# Altium schematic sheet filter_circuit.SchDoc
size A4
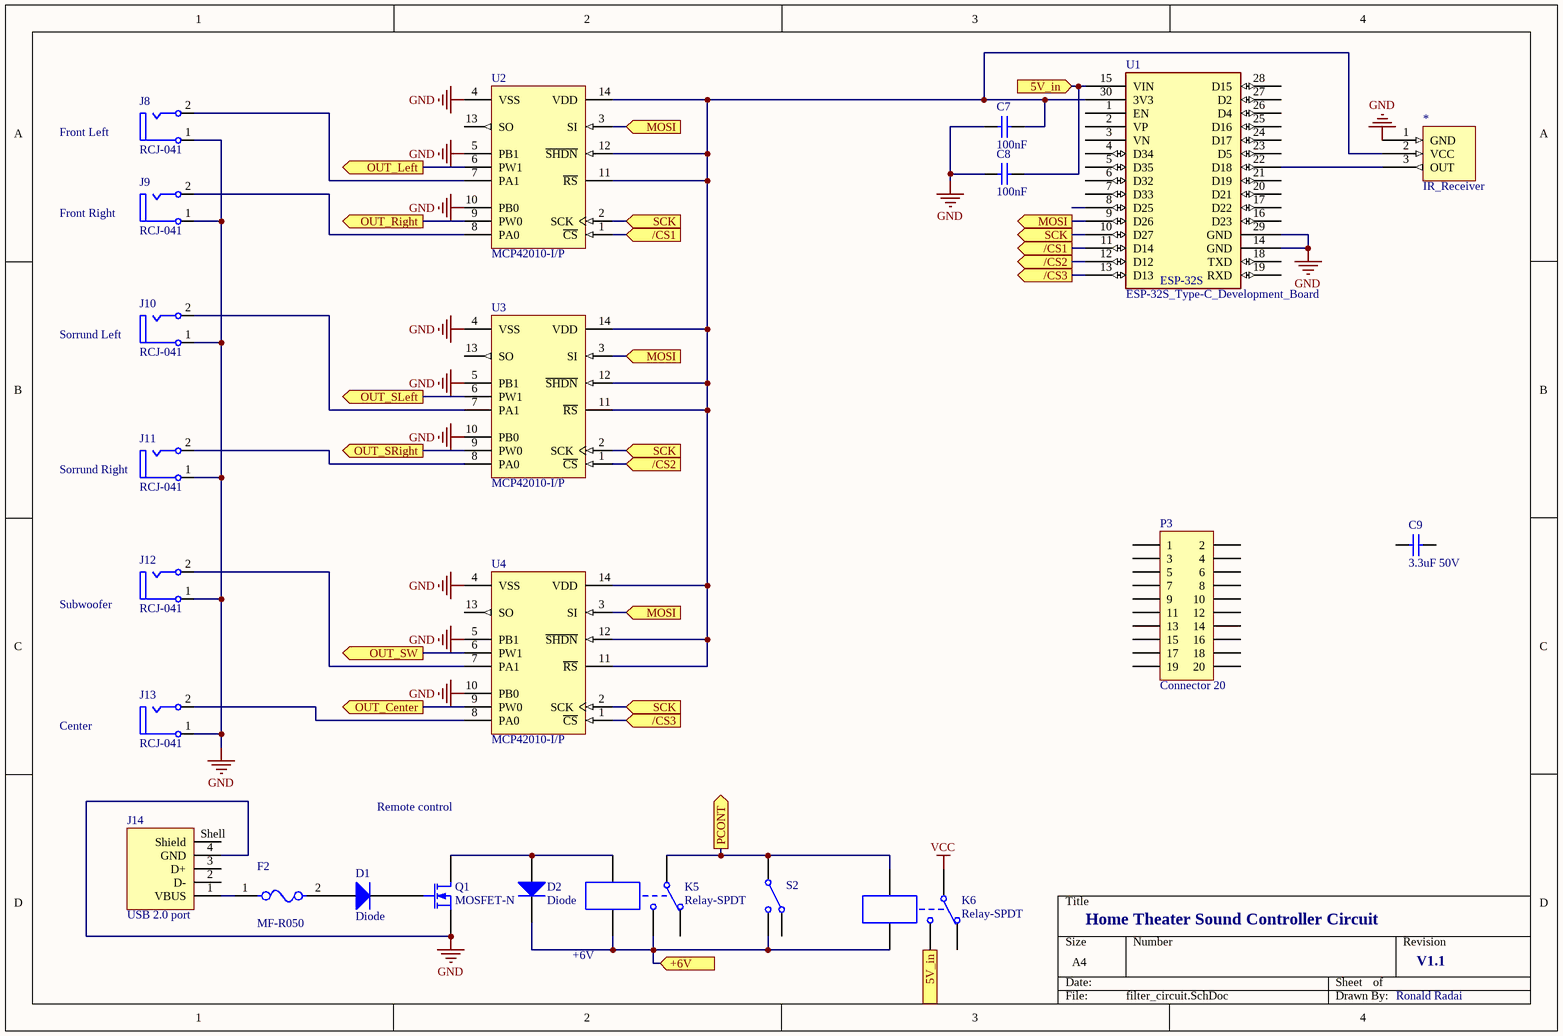
[diagram p0: filter_circuit.SchDoc]

## Parts
*  IR_Receiver
C7  100nF  [FP_0805_CAP_085]
C8  100nF  [FP_0805_CAP_085]
C9  3.3uF 50V  [FP_0805_CAP_085]
D1  Diode  [SMC]
D2  Diode  [SMC]
F2  MF-R050  [FP-MF-R050-MFG]
J8  RCJ-041  [CUI-RCJ-041_V]
J9  RCJ-041  [CUI-RCJ-041_V]
J10  RCJ-041  [CUI-RCJ-041_V]
J11  RCJ-041  [CUI-RCJ-041_V]
J12  RCJ-041  [CUI-RCJ-041_V]
J13  RCJ-041  [CUI-RCJ-041_V]
J14  USB 2.0 port  [629104151021]
K5  Relay-SPDT  [MODULE5B]
K6  Relay-SPDT  [MODULE5B]
P3  Connector 20  [CONNECTOR-20P]
Q1  MOSFET-N  [E3]
S2  Single-Pole, Double-Throw Switch  (value not drawn)
U1  ESP-32S_Type-C_Development_Board  [FP-ESP32-C3-DevKitC-02-MFG]
U2  MCP42010-I/P  [PDIP300-P14]
U3  MCP42010-I/P  [PDIP300-P14]
U4  MCP42010-I/P  [PDIP300-P14]

## Ports
5V_in (in), 5V_in (out), +6V (in), /CS1 (in), /CS1 (out), /CS2 (in), /CS2 (out), /CS3 (in), /CS3 (out), MOSI (in), MOSI (out), OUT_Center (out), OUT_Left (out), OUT_Right (out), OUT_SLeft (out), OUT_SRight (out), OUT_SW (out), PCONT (out), SCK (in), SCK (out)

## Nets
GND: *.1(GND) C7.2 C8.2 J8.1 J9.1 J10.1 J11.1 J12.1 J13.1 J14.4(GND) Q1.3(S) U1.14(GND) U1.29(GND) U2.4(VSS) U2.5(PB1) U2.10(PB0) U3.4(VSS) U3.5(PB1) U3.10(PB0) U4.4(VSS) U4.5(PB1) U4.10(PB0)
VCC: K6.1
5V_in: C8.1 K6.3 U1.15(VIN) ; port 5V_in
+6V: D2.2(K) K5.3 K5.5 K6.5 S2.2 ; port +6V
/CS1: U1.11(D14) U2.1(~{CS}) ; port /CS1
/CS2: U1.12(D12) U3.1(~{CS}) ; port /CS2
/CS3: U1.13(D13) U4.1(~{CS}) ; port /CS3
MOSI: U1.9(D26) U2.3(SI) U3.3(SI) U4.3(SI) ; port MOSI
OUT_Center: U4.9(PW0) ; port OUT_Center
OUT_Left: U2.6(PW1) ; port OUT_Left
OUT_Right: U2.9(PW0) ; port OUT_Right
OUT_SLeft: U3.6(PW1) ; port OUT_SLeft
OUT_SRight: U3.9(PW0) ; port OUT_SRight
OUT_SW: U4.6(PW1) ; port OUT_SW
PCONT: K5.1 K6.4 S2.1 ; port PCONT
SCK: U1.10(D27) U2.2(SCK) U3.2(SCK) U4.2(SCK) ; port SCK
Net*_2: *.2(VCC) C7.1 U1.30(3V3) U2.11(~{RS}) U2.12(~{SHDN}) U2.14(VDD) U3.11(~{RS}) U3.12(~{SHDN}) U3.14(VDD) U4.11(~{RS}) U4.12(~{SHDN}) U4.14(VDD)
Net*_3: *.3(OUT) U1.22(D18)
NetD1_1: D1.1(A) F2.2
NetD1_2: D1.2(K) Q1.2(G)
NetD2_1: D2.1(A) K5.4 Q1.1(D)
NetF2_1: F2.1 J14.1(VBUS)
NetJ8_2: J8.2 U2.7(PA1)
NetJ9_2: J9.2 U2.8(PA0)
NetJ10_2: J10.2 U3.7(PA1)
NetJ11_2: J11.2 U3.8(PA0)
NetJ12_2: J12.2 U4.7(PA1)
NetJ13_2: J13.2 U4.8(PA0)

Not connected (* = marked no-connect by the designer): C9 1 2; J14 2(D-) 3(D+) Shell(Shield); K5 2; K6 2; P3 1 2 3 4 5 6 7 8 9 10 11 12 13 14 15 16 17 18 19 20; S2 3; U1 1(EN) 2(VP) 3(VN) 4(D34) 5(D35) 6(D32) 7(D33) 8(D25) 16(D23) 17(D22) 18(TXD) 19(RXD) 20(D21) 21(D19) 23(D5) 24(D17) 25(D16) 26(D4) 27(D2) 28(D15); U2 13(SO); U3 13(SO); U4 13(SO)

## Notes on the sheet
- Front Left
- Front Right
- (near J10) Sorrund Left
- (near J11) Sorrund Right
- Subwoofer
- Center
- Remote control
- Home Theater Sound Controller Circuit
- +6V
- V1.1
- Ronald Radai
- (in symbol ESP-32S_TypeC_DevKit) ESP-32S

## Library data of the parts
C7-C9 = CAP: Capacitor
  C7 C8: Value: 100nF
  C9: Value: 3.3uF 50V
D1 D2 = Diode: Default Diode; Published: 8-Jun-2000; LatestRevisionDate: 17-Jul-2002; LatestRevisionNote: Re-released for DXP Platform.; PackageVersion: Sep-1996; PackageReference: SMC; Publisher: Altium Limited; PackageDescription: DO-214-AB/SMC; 2 C-Bend Leads; Body 7.9 x 5.9 mm, inc. leads (LxW); Code_JEDEC: DO-214-AB
F2 = CMP-07400-000037-1: PTC RESET FUSE 60V 500MA RADIAL; Manufacturer: Bourns; Current Rating: 40A; Trip Time: 4s; Resistance: 0.41-0.77Ω; Value: 0.41-0.77Ω; Trip Current: 1A; Hold Current: 0.5A; Automotive: No; Device Class L1: Circuit Protection; Ambient Temperature Range Low: -40°C; Height: 13.7mm; Category: Fuse; ComponentLink2Description: Datasheet; Device Class L3: unset; Mouser Description: PTC Resettable Fuse 0.5A(hold) 1A(trip) 60V 40A 0.75W 4s 0.41Ohm Radial 7.9 X 3.1mm Bulk; RoHS: TRUE; Temperature Range High: +85°C; Octopart: https://octopart.com/mf-r050-bourns-19418; Temperature Range Low: -40°C; Device Class L2: PTC Resettable Fuses; Package: MF-R050; Manufacturer Part Number: MF-R050; Temperature: -40°C to +85°C; Ambient Temperature Range High: +85°C; ComponentLink2URL: https://upverter.com/datasheet/a1b715b2a3574ae967878e49fe70c2811aecae4b.pdf; Digikey Description: PTC RESET FUSE 60V 500MA RADIAL; Lead Free: Yes; Voltage Rating: 60V
J8-J13 = CMP-1692-00002-1: Female RCJ Jack, 2 Position, Height 11.724 mm, Tail Length 4 mm, RoHS, Bulk; Case\Package: Metal; Connector Type: HDMI; Current Rating: 500 mA; Voltage Rating: 40 V; Length: 16.2 mm; Pins: 19; ComponentLink1URL: http://www.cui.com/; ComponentLink1Description: Manufacturer URL; Packaging: Tape and Reel; Lead Pitch: 0.5 mm; PackageDescription: Female RCJ Jack, 2 Position, Height 11.724 mm, Tail Length 4 mm; RoHSCompliant: true; Min Operating Temperature: -55 degC; Height: 6.1 mm; Contact Material: Copper; REACH SVHC: No SVHC; DatasheetVersion: Rev. B, 02/2012; ComponentLink2Description: Datasheet; Contact Plating: Gold; Colour: Black; Max Operating Temperature: 85 degC; Mount: Surface Mount; Package Quantity: 400; Gender: Female; ComponentLink2URL: http://www.cui.com/product/resource/rcj-04x.pdf; PackageReference: RCJ-041
J14 = CMP-1502-03241-3: NexarPartId: 52645112; USB Standard: USB 2.0; Insulation Resistance: 1GΩ; Current Rating: 1.5A; Number of Contacts: 4; Contact Resistance: 30mΩ; Gender: Receptacle; Operating Supply Voltage: 30V; Mount: Horizontal, Surface Mount; RoHS: Compliant; Max Operating Temperature: 85°C; Min Operating Temperature: -40°C; Contact Plating: Gold; Contact Material: Gold, Nickel; Number of Pins: 4; Packaging: Tape and Reel; Connector Type: USB; Height: 7.2mm; Orientation: Horizontal; Voltage Rating: 30V; Termination: SMD/SMT; Features: Shielded; REACH SVHC: Unknown
K5 K6 = Relay-SPDT: Single-Pole Dual-Throw Relay; Published: 24-Mar-1999; LatestRevisionDate: 17-Jul-2002; LatestRevisionNote: Re-released for DXP Platform.; PackageReference: MODULE5B; Publisher: Altium Limited
P3 = Connector 20: Ribbon cable connector; Reference: *; Supplier: *; Name: *
Q1 = MOSFET-N: N-Channel MOSFET; Published: 8-Jun-2000; LatestRevisionDate: 17-Jul-2002; LatestRevisionNote: Re-released for DXP Platform.; PackageVersion: 1995/1996; PackageReference: E3; Publisher: Altium Limited; PackageDescription: TO, Flat Index; 3 In-Line, Axial Leads; Body Dia. 4.6mm; Lead Dia. 0.5 mm (max)
S2 = SPDT SW: nodeUP_closed: 1; Rclosed: 1m; Ropen: 1Meg; SimulationGenericComponent: True
U1 = ESP-32S_TypeC_DevKit
U2-U4 = CMP-0188-00252-2: Single/Dual Digital Potentiometer with SPI Interface, 14-Pin PDIP, Industrial Temperature; PackageVersion: revBB, Aug-2009; ComponentLink1URL: http://www.microchip.com/; ComponentLink3Description: Package Specification; DatasheetVersion: Jul-2003; PackageReference: PDIP300-P14; PackageDescription: 14-Lead Plastic Dual In-Line (P) - 300 mil Body [PDIP]; ComponentLink1Description: Manufacturer URL; ComponentLink3URL: http://www.microchip.com/stellent/groups/techpub_sg/documents/packagingspec/en012702.pdf; ComponentLink2Description: Datasheet; RevisionNote: URLs added.; ComponentLink2URL: http://ww1.microchip.com/downloads/en/DeviceDoc/11195c.pdf